# EAGLE design radiata_v2 (EAGLE 6.4)
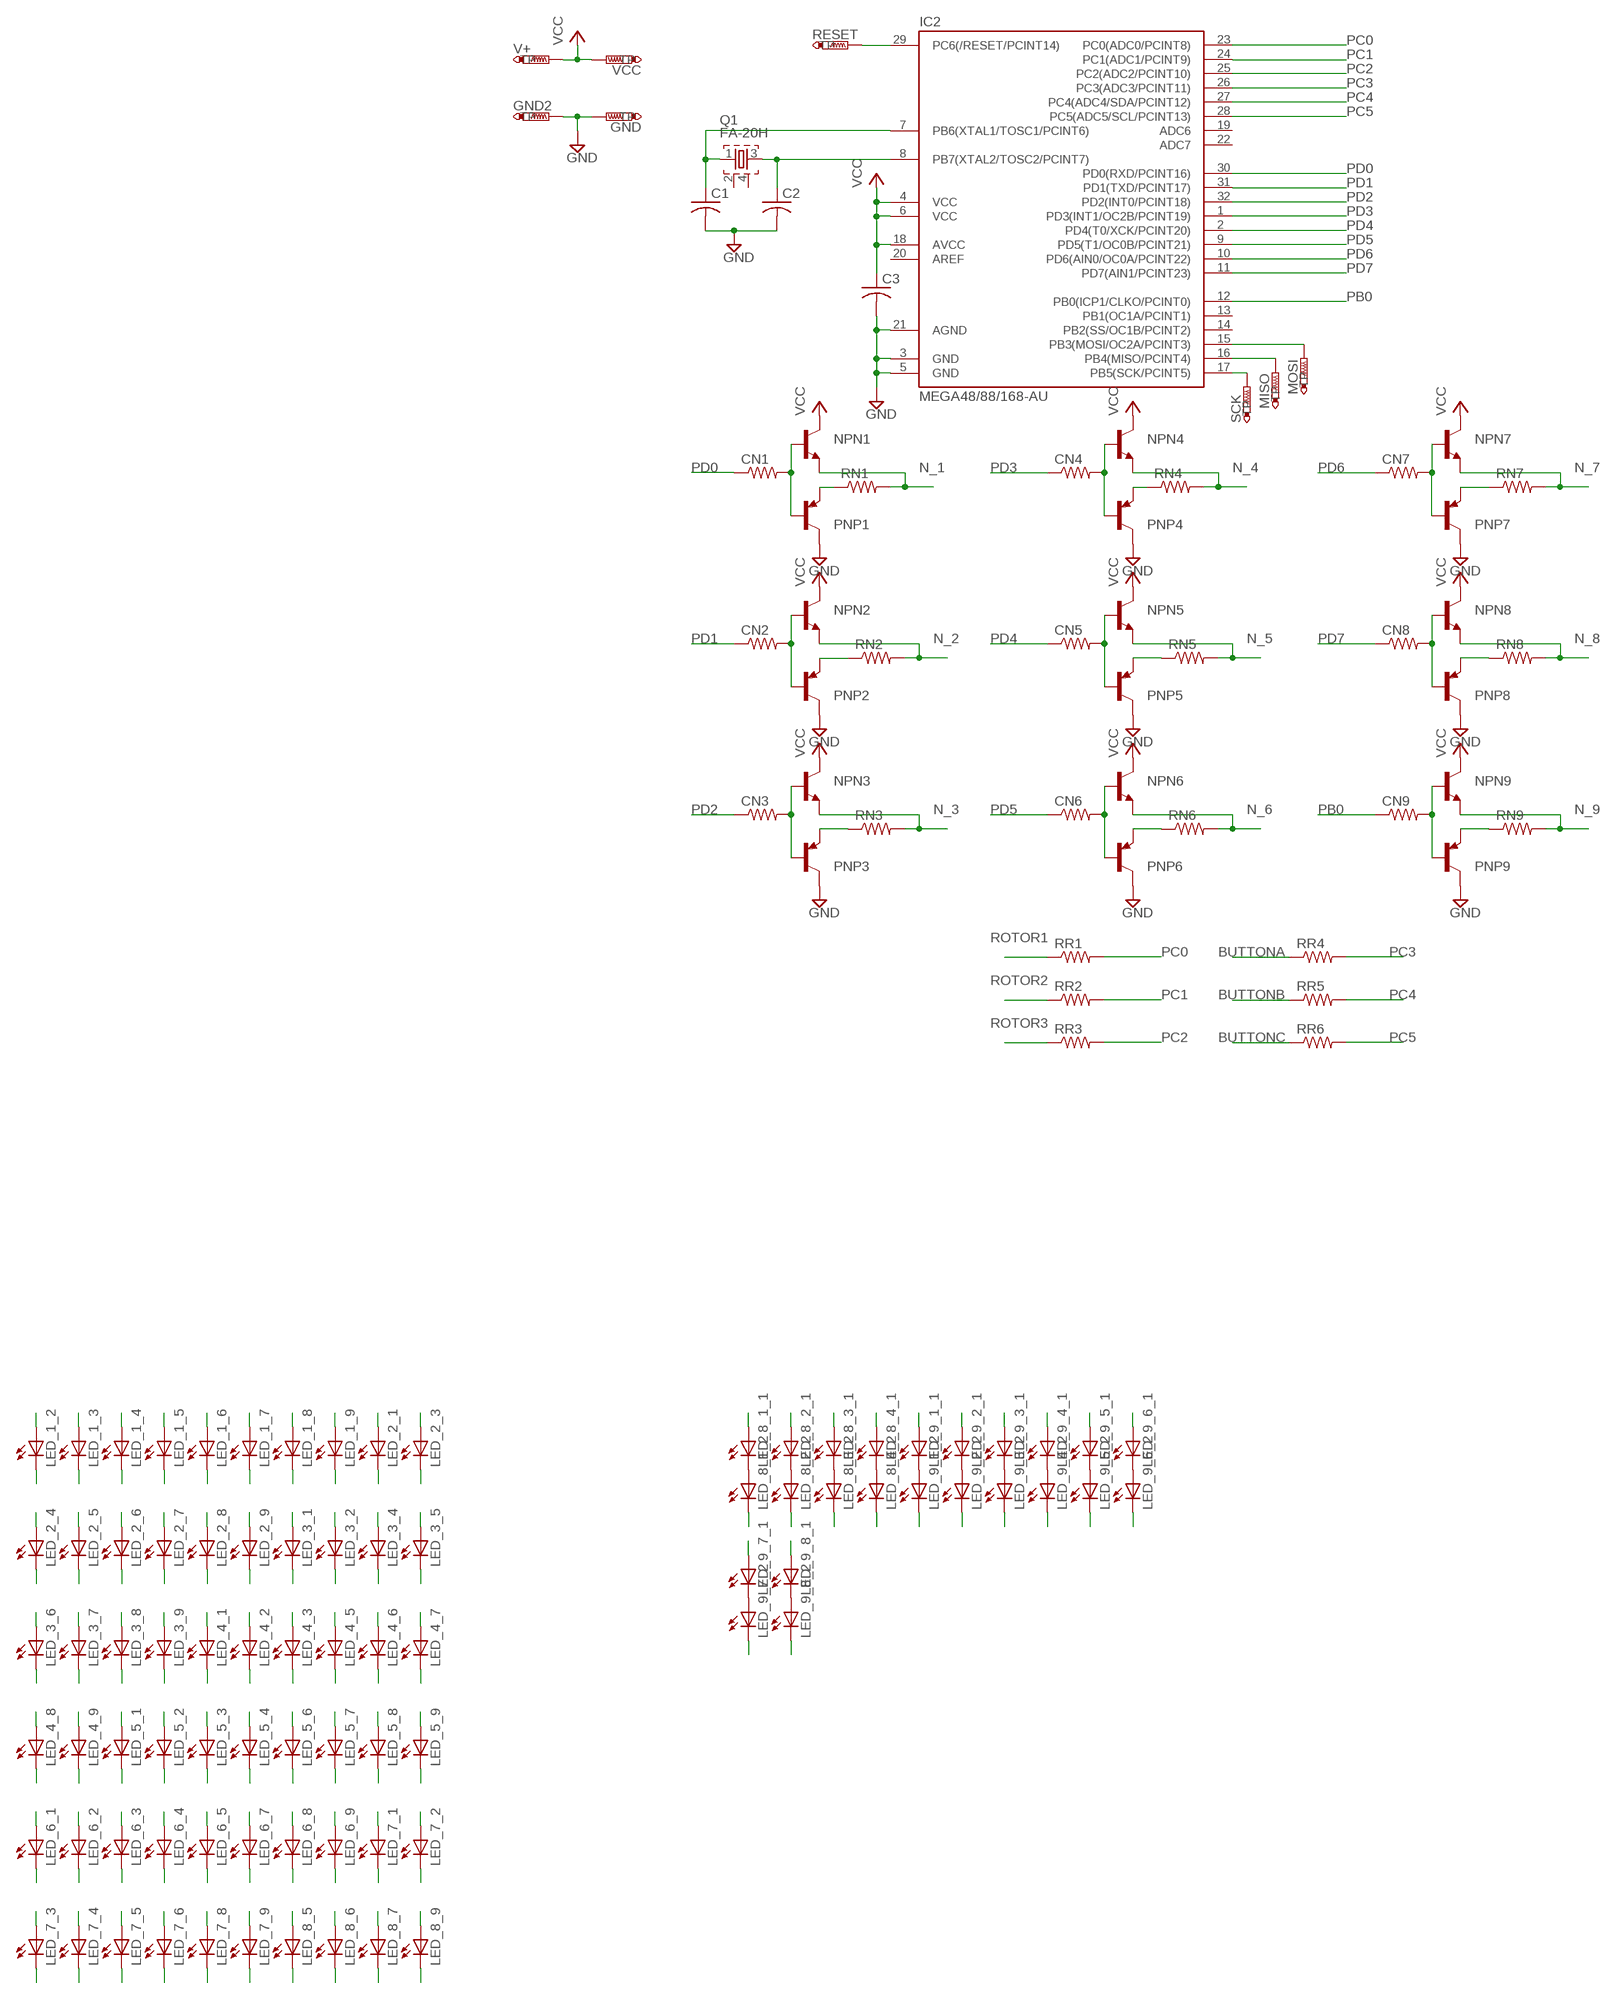
[diagram p0: schematic, sheet 1]

## Parts
C1  C-USC0603  [C0603]
C2  C-USC0603  [C0603]
C3  C-USC0603  [C0603]
CN1  R-US_M0805  [M0805]
CN2  R-US_M0805  [M0805]
CN3  R-US_M0805  [M0805]
CN4  R-US_M0805  [M0805]
CN5  R-US_M0805  [M0805]
CN6  R-US_M0805  [M0805]
CN7  R-US_M0805  [M0805]
CN8  R-US_M0805  [M0805]
CN9  R-US_M0805  [M0805]
GND  PTR1TP19R  [TP19R]
GND2  PTR1TP20SQ  [TP20SQ]
IC2  MEGA48/88/168-AU  [TQFP32-08]
LED_1_2  LED1206  [LED-1206]
LED_1_3  LED1206  [LED-1206]
LED_1_4  LED1206  [LED-1206]
LED_1_5  LED1206  [LED-1206]
LED_1_6  LED1206  [LED-1206]
LED_1_7  LED1206  [LED-1206]
LED_1_8  LED1206  [LED-1206]
LED_1_9  LED1206  [LED-1206]
LED_2_1  LED1206  [LED-1206]
LED_2_3  LED1206  [LED-1206]
LED_2_4  LED1206  [LED-1206]
LED_2_5  LED1206  [LED-1206]
LED_2_6  LED1206  [LED-1206]
LED_2_7  LED1206  [LED-1206]
LED_2_8  LED1206  [LED-1206]
LED_2_9  LED1206  [LED-1206]
LED_3_1  LED1206  [LED-1206]
LED_3_2  LED1206  [LED-1206]
LED_3_4  LED1206  [LED-1206]
LED_3_5  LED1206  [LED-1206]
LED_3_6  LED1206  [LED-1206]
LED_3_7  LED1206  [LED-1206]
LED_3_8  LED1206  [LED-1206]
LED_3_9  LED1206  [LED-1206]
LED_4_1  LED1206  [LED-1206]
LED_4_2  LED1206  [LED-1206]
LED_4_3  LED1206  [LED-1206]
LED_4_5  LED1206  [LED-1206]
LED_4_6  LED1206  [LED-1206]
LED_4_7  LED1206  [LED-1206]
LED_4_8  LED1206  [LED-1206]
LED_4_9  LED1206  [LED-1206]
LED_5_1  LED1206  [LED-1206]
LED_5_2  LED1206  [LED-1206]
LED_5_3  LED1206  [LED-1206]
LED_5_4  LED1206  [LED-1206]
LED_5_6  LED1206  [LED-1206]
LED_5_7  LED1206  [LED-1206]
LED_5_8  LED1206  [LED-1206]
LED_5_9  LED1206  [LED-1206]
LED_6_1  LED1206  [LED-1206]
LED_6_2  LED1206  [LED-1206]
LED_6_3  LED1206  [LED-1206]
LED_6_4  LED1206  [LED-1206]
LED_6_5  LED1206  [LED-1206]
LED_6_7  LED1206  [LED-1206]
LED_6_8  LED1206  [LED-1206]
LED_6_9  LED1206  [LED-1206]
LED_7_1  LED1206  [LED-1206]
LED_7_2  LED1206  [LED-1206]
LED_7_3  LED1206  [LED-1206]
LED_7_4  LED1206  [LED-1206]
LED_7_5  LED1206  [LED-1206]
LED_7_6  LED1206  [LED-1206]
LED_7_8  LED1206  [LED-1206]
LED_7_9  LED1206  [LED-1206]
LED_8_1_1  LED1206  [LED-1206]
LED_8_1_2  LED1206  [LED-1206]
LED_8_2_1  LED1206  [LED-1206]
LED_8_2_2  LED1206  [LED-1206]
LED_8_3_1  LED1206  [LED-1206]
LED_8_3_2  LED1206  [LED-1206]
LED_8_4_1  LED1206  [LED-1206]
LED_8_4_2  LED1206  [LED-1206]
LED_8_5  LED1206  [LED-1206]
LED_8_6  LED1206  [LED-1206]
LED_8_7  LED1206  [LED-1206]
LED_8_9  LED1206  [LED-1206]
LED_9_1_1  LED1206  [LED-1206]
LED_9_1_2  LED1206  [LED-1206]
LED_9_2_1  LED1206  [LED-1206]
LED_9_2_2  LED1206  [LED-1206]
LED_9_3_1  LED1206  [LED-1206]
LED_9_3_2  LED1206  [LED-1206]
LED_9_4_1  LED1206  [LED-1206]
LED_9_4_2  LED1206  [LED-1206]
LED_9_5_1  LED1206  [LED-1206]
LED_9_5_2  LED1206  [LED-1206]
LED_9_6_1  LED1206  [LED-1206]
LED_9_6_2  LED1206  [LED-1206]
LED_9_7_1  LED1206  [LED-1206]
LED_9_7_2  LED1206  [LED-1206]
LED_9_8_1  LED1206  [LED-1206]
LED_9_8_2  LED1206  [LED-1206]
MISO  PTR1TP19R  [TP19R]
MOSI  PTR1TP19R  [TP19R]
NPN1  MMBT2222ALT1-NPN-SOT23-BEC  [SOT23-BEC]
NPN2  MMBT2222ALT1-NPN-SOT23-BEC  [SOT23-BEC]
NPN3  MMBT2222ALT1-NPN-SOT23-BEC  [SOT23-BEC]
NPN4  MMBT2222ALT1-NPN-SOT23-BEC  [SOT23-BEC]
NPN5  MMBT2222ALT1-NPN-SOT23-BEC  [SOT23-BEC]
NPN6  MMBT2222ALT1-NPN-SOT23-BEC  [SOT23-BEC]
NPN7  MMBT2222ALT1-NPN-SOT23-BEC  [SOT23-BEC]
NPN8  MMBT2222ALT1-NPN-SOT23-BEC  [SOT23-BEC]
NPN9  MMBT2222ALT1-NPN-SOT23-BEC  [SOT23-BEC]
PNP1  MMBT2907ALT1-PNP-SOT23-BEC  [SOT23-BEC]
PNP2  MMBT2907ALT1-PNP-SOT23-BEC  [SOT23-BEC]
PNP3  MMBT2907ALT1-PNP-SOT23-BEC  [SOT23-BEC]
PNP4  MMBT2907ALT1-PNP-SOT23-BEC  [SOT23-BEC]
PNP5  MMBT2907ALT1-PNP-SOT23-BEC  [SOT23-BEC]
PNP6  MMBT2907ALT1-PNP-SOT23-BEC  [SOT23-BEC]
PNP7  MMBT2907ALT1-PNP-SOT23-BEC  [SOT23-BEC]
PNP8  MMBT2907ALT1-PNP-SOT23-BEC  [SOT23-BEC]
PNP9  MMBT2907ALT1-PNP-SOT23-BEC  [SOT23-BEC]
Q1  FA-20H  [FA-20H]
RESET  PTR1TP19R  [TP19R]
RN1  RESISTOR1206  [1206]
RN2  RESISTOR1206  [1206]
RN3  RESISTOR1206  [1206]
RN4  RESISTOR1206  [1206]
RN5  RESISTOR1206  [1206]
RN6  RESISTOR1206  [1206]
RN7  RESISTOR1206  [1206]
RN8  RESISTOR1206  [1206]
RN9  RESISTOR1206  [1206]
RR1  RESISTOR1206  [1206]
RR2  RESISTOR1206  [1206]
RR3  RESISTOR1206  [1206]
RR4  RESISTOR1206  [1206]
RR5  RESISTOR1206  [1206]
RR6  RESISTOR1206  [1206]
SCK  PTR1TP19R  [TP19R]
V+  PTR1TP20SQ  [TP20SQ]
VCC  PTR1TP19R  [TP19R]

## Nets
BUTTONA: RR4.1
BUTTONB: RR5.1
BUTTONC: RR6.1
GND: C1.2 C2.2 C3.2 GND2.TP GND.TP IC2.3(GND) IC2.5(GND) IC2.21(AGND) PNP1.C PNP2.C PNP3.C PNP4.C PNP5.C PNP6.C PNP7.C PNP8.C PNP9.C
N$5: IC2.29(PC6(/RESET/PCINT14)) RESET.TP
N$6: IC2.17(PB5(SCK/PCINT5)) SCK.TP
N$7: IC2.16(PB4(MISO/PCINT4)) MISO.TP
N$8: IC2.15(PB3(MOSI/OC2A/PCINT3)) MOSI.TP
N$9: PNP1.E RN1.1
N$10: CN1.2 NPN1.B PNP1.B
N$11: PNP2.E RN2.1
N$12: CN2.2 NPN2.B PNP2.B
N$13: PNP3.E RN3.1
N$14: CN3.2 NPN3.B PNP3.B
N$15: PNP4.E RN4.1
N$16: CN4.2 NPN4.B PNP4.B
N$17: PNP5.E RN5.1
N$18: CN5.2 NPN5.B PNP5.B
N$19: PNP6.E RN6.1
N$20: CN6.2 NPN6.B PNP6.B
N$21: C2.1 IC2.8(PB7(XTAL2/TOSC2/PCINT7)) Q1.3
N$22: LED_8_1_1.C LED_8_1_2.A
N$23: LED_8_2_1.C LED_8_2_2.A
N$24: PNP7.E RN7.1
N$25: CN7.2 NPN7.B PNP7.B
N$26: PNP8.E RN8.1
N$27: CN8.2 NPN8.B PNP8.B
N$28: PNP9.E RN9.1
N$29: CN9.2 NPN9.B PNP9.B
N$30: LED_8_3_1.C LED_8_3_2.A
N$31: LED_8_4_1.C LED_8_4_2.A
N$32: LED_9_1_1.C LED_9_1_2.A
N$33: LED_9_2_1.C LED_9_2_2.A
N$34: LED_9_3_1.C LED_9_3_2.A
N$35: LED_9_4_1.C LED_9_4_2.A
N$36: LED_9_5_1.C LED_9_5_2.A
N$37: LED_9_6_1.C LED_9_6_2.A
N$38: LED_9_7_1.C LED_9_7_2.A
N$39: LED_9_8_1.C LED_9_8_2.A
N_1: LED_1_2.A LED_1_3.A LED_1_4.A LED_1_5.A LED_1_6.A LED_1_7.A LED_1_8.A LED_1_9.A LED_2_1.C LED_3_1.C LED_4_1.C LED_5_1.C LED_6_1.C LED_7_1.C LED_8_1_2.C LED_9_1_2.C NPN1.E RN1.2
N_2: LED_1_2.C LED_2_1.A LED_2_3.A LED_2_4.A LED_2_5.A LED_2_6.A LED_2_7.A LED_2_8.A LED_2_9.A LED_3_2.C LED_4_2.C LED_5_2.C LED_6_2.C LED_7_2.C LED_8_2_2.C LED_9_2_2.C NPN2.E RN2.2
N_3: LED_1_3.C LED_2_3.C LED_3_1.A LED_3_2.A LED_3_4.A LED_3_5.A LED_3_6.A LED_3_7.A LED_3_8.A LED_3_9.A LED_4_3.C LED_5_3.C LED_6_3.C LED_7_3.C LED_8_3_2.C LED_9_3_2.C NPN3.E RN3.2
N_4: LED_1_4.C LED_2_4.C LED_3_4.C LED_4_1.A LED_4_2.A LED_4_3.A LED_4_5.A LED_4_6.A LED_4_7.A LED_4_8.A LED_4_9.A LED_5_4.C LED_6_4.C LED_7_4.C LED_8_4_2.C LED_9_4_2.C NPN4.E RN4.2
N_5: LED_1_5.C LED_2_5.C LED_3_5.C LED_4_5.C LED_5_1.A LED_5_2.A LED_5_3.A LED_5_4.A LED_5_6.A LED_5_7.A LED_5_8.A LED_5_9.A LED_6_5.C LED_7_5.C LED_8_5.C LED_9_5_2.C NPN5.E RN5.2
N_6: LED_1_6.C LED_2_6.C LED_3_6.C LED_4_6.C LED_5_6.C LED_6_1.A LED_6_2.A LED_6_3.A LED_6_4.A LED_6_5.A LED_6_7.A LED_6_8.A LED_6_9.A LED_7_6.C LED_8_6.C LED_9_6_2.C NPN6.E RN6.2
N_7: LED_1_7.C LED_2_7.C LED_3_7.C LED_4_7.C LED_5_7.C LED_6_7.C LED_7_1.A LED_7_2.A LED_7_3.A LED_7_4.A LED_7_5.A LED_7_6.A LED_7_8.A LED_7_9.A LED_8_7.C LED_9_7_2.C NPN7.E RN7.2
N_8: LED_1_8.C LED_2_8.C LED_3_8.C LED_4_8.C LED_5_8.C LED_6_8.C LED_7_8.C LED_8_1_1.A LED_8_2_1.A LED_8_3_1.A LED_8_4_1.A LED_8_5.A LED_8_6.A LED_8_7.A LED_8_9.A LED_9_8_2.C NPN8.E RN8.2
N_9: LED_1_9.C LED_2_9.C LED_3_9.C LED_4_9.C LED_5_9.C LED_6_9.C LED_7_9.C LED_8_9.C LED_9_1_1.A LED_9_2_1.A LED_9_3_1.A LED_9_4_1.A LED_9_5_1.A LED_9_6_1.A LED_9_7_1.A LED_9_8_1.A NPN9.E RN9.2
PB0: CN9.1 IC2.12(PB0(ICP1/CLKO/PCINT0))
PB1: C1.1 IC2.7(PB6(XTAL1/TOSC1/PCINT6)) Q1.1
PC0: IC2.23(PC0(ADC0/PCINT8)) RR1.2
PC1: IC2.24(PC1(ADC1/PCINT9)) RR2.2
PC2: IC2.25(PC2(ADC2/PCINT10)) RR3.2
PC3: IC2.26(PC3(ADC3/PCINT11)) RR4.2
PC4: IC2.27(PC4(ADC4/SDA/PCINT12)) RR5.2
PC5: IC2.28(PC5(ADC5/SCL/PCINT13)) RR6.2
PD0: CN1.1 IC2.30(PD0(RXD/PCINT16))
PD1: CN2.1 IC2.31(PD1(TXD/PCINT17))
PD2: CN3.1 IC2.32(PD2(INT0/PCINT18))
PD3: CN4.1 IC2.1(PD3(INT1/OC2B/PCINT19))
PD4: CN5.1 IC2.2(PD4(T0/XCK/PCINT20))
PD5: CN6.1 IC2.9(PD5(T1/OC0B/PCINT21))
PD6: CN7.1 IC2.10(PD6(AIN0/OC0A/PCINT22))
PD7: CN8.1 IC2.11(PD7(AIN1/PCINT23))
ROTOR1: RR1.1
ROTOR2: RR2.1
ROTOR3: RR3.1
VCC: C3.1 IC2.4(VCC) IC2.6(VCC) IC2.18(AVCC) NPN1.C NPN2.C NPN3.C NPN4.C NPN5.C NPN6.C NPN7.C NPN8.C NPN9.C V+.TP VCC.TP
Unconnected: IC2.13(PB1(OC1A/PCINT1)) IC2.14(PB2(SS/OC1B/PCINT2)) IC2.19(ADC6) IC2.20(AREF) IC2.22(ADC7) Q1.2 Q1.4

## Library data of the parts
C1-C3 = rcl:C-US: CAPACITOR, American symbol
CN1-CN9 = rcl:R-US_: RESISTOR, American symbol
GND GND2 MISO MOSI RESET SCK V+ VCC = testpad:PTR1: TEST PIN
IC2 = avr-7:MEGA48/88/168
LED_1_2-LED_1_9 LED_2_1 LED_2_3-LED_2_9 LED_3_1 LED_3_2 LED_3_4-LED_3_9 LED_4_1-LED_4_3 LED_4_5-LED_4_9 LED_5_1-LED_5_4 LED_5_6-LED_5_9 LED_6_1-LED_6_5 LED_6_7-LED_6_9 LED_7_1-LED_7_6 LED_7_8 LED_7_9 LED_8_1_1 LED_8_1_2 LED_8_2_1 LED_8_2_2 LED_8_3_1 LED_8_3_2 LED_8_4_1 LED_8_4_2 LED_8_5-LED_8_7 LED_8_9 LED_9_1_1 LED_9_1_2 LED_9_2_1 LED_9_2_2 LED_9_3_1 LED_9_3_2 LED_9_4_1 LED_9_4_2 LED_9_5_1 LED_9_5_2 LED_9_6_1 LED_9_6_2 LED_9_7_1 LED_9_7_2 LED_9_8_1 LED_9_8_2 = SparkFun:LED: LEDs Standard schematic elements and footprints for 5mm, 3mm, 1206, and 0603 sized LEDs. 5mm - Spark Fun Electronics SKU : COM-00529 (and others)
NPN1-NPN9 = transistor:*-NPN-: NPN Transistror BF959 corrected 2008.03.06
PNP1-PNP9 = transistor:*-PNP-: PNP Transistror
Q1 = crystal:FA-: MHz RANGE CRYSTAL UNIT Source: Epson Toyocom
RN1-RN9 RR1-RR6 = SparkFun:RESISTOR: Resistor Basic schematic elements and footprints for 0603, 1206, and PTH resistors.

## Board
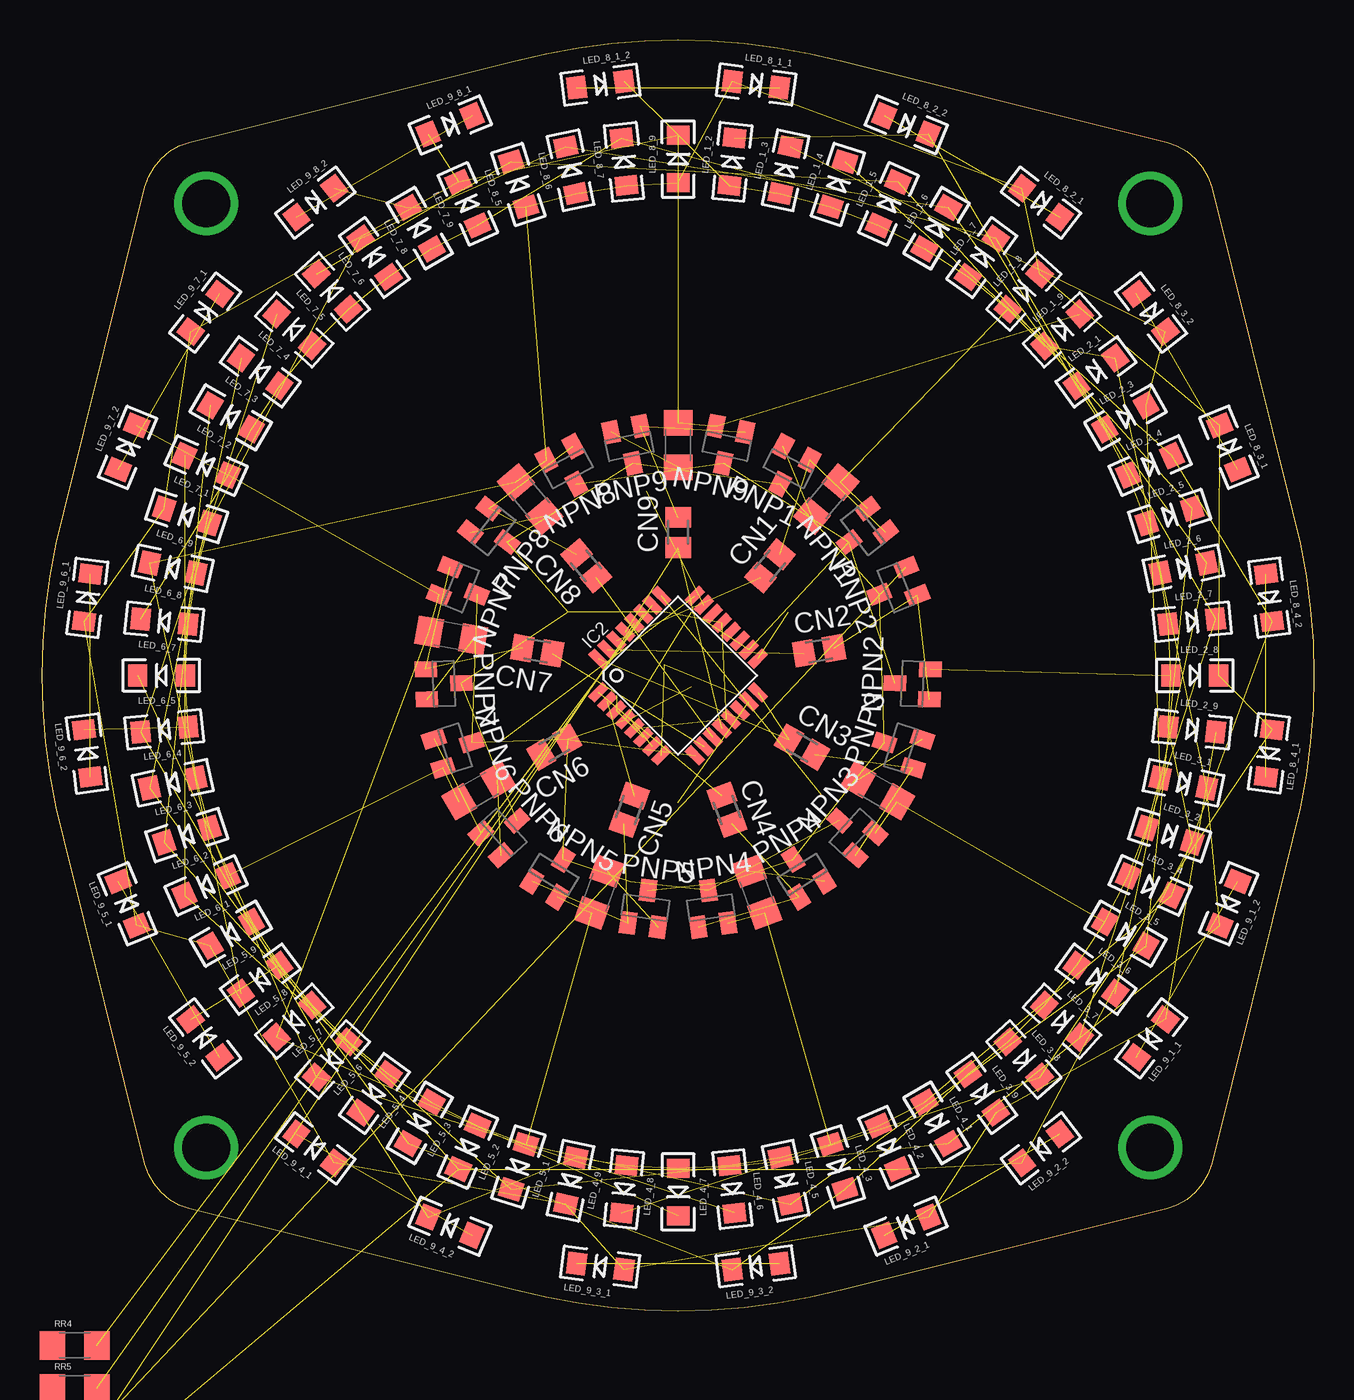
[diagram p1: board, top side]
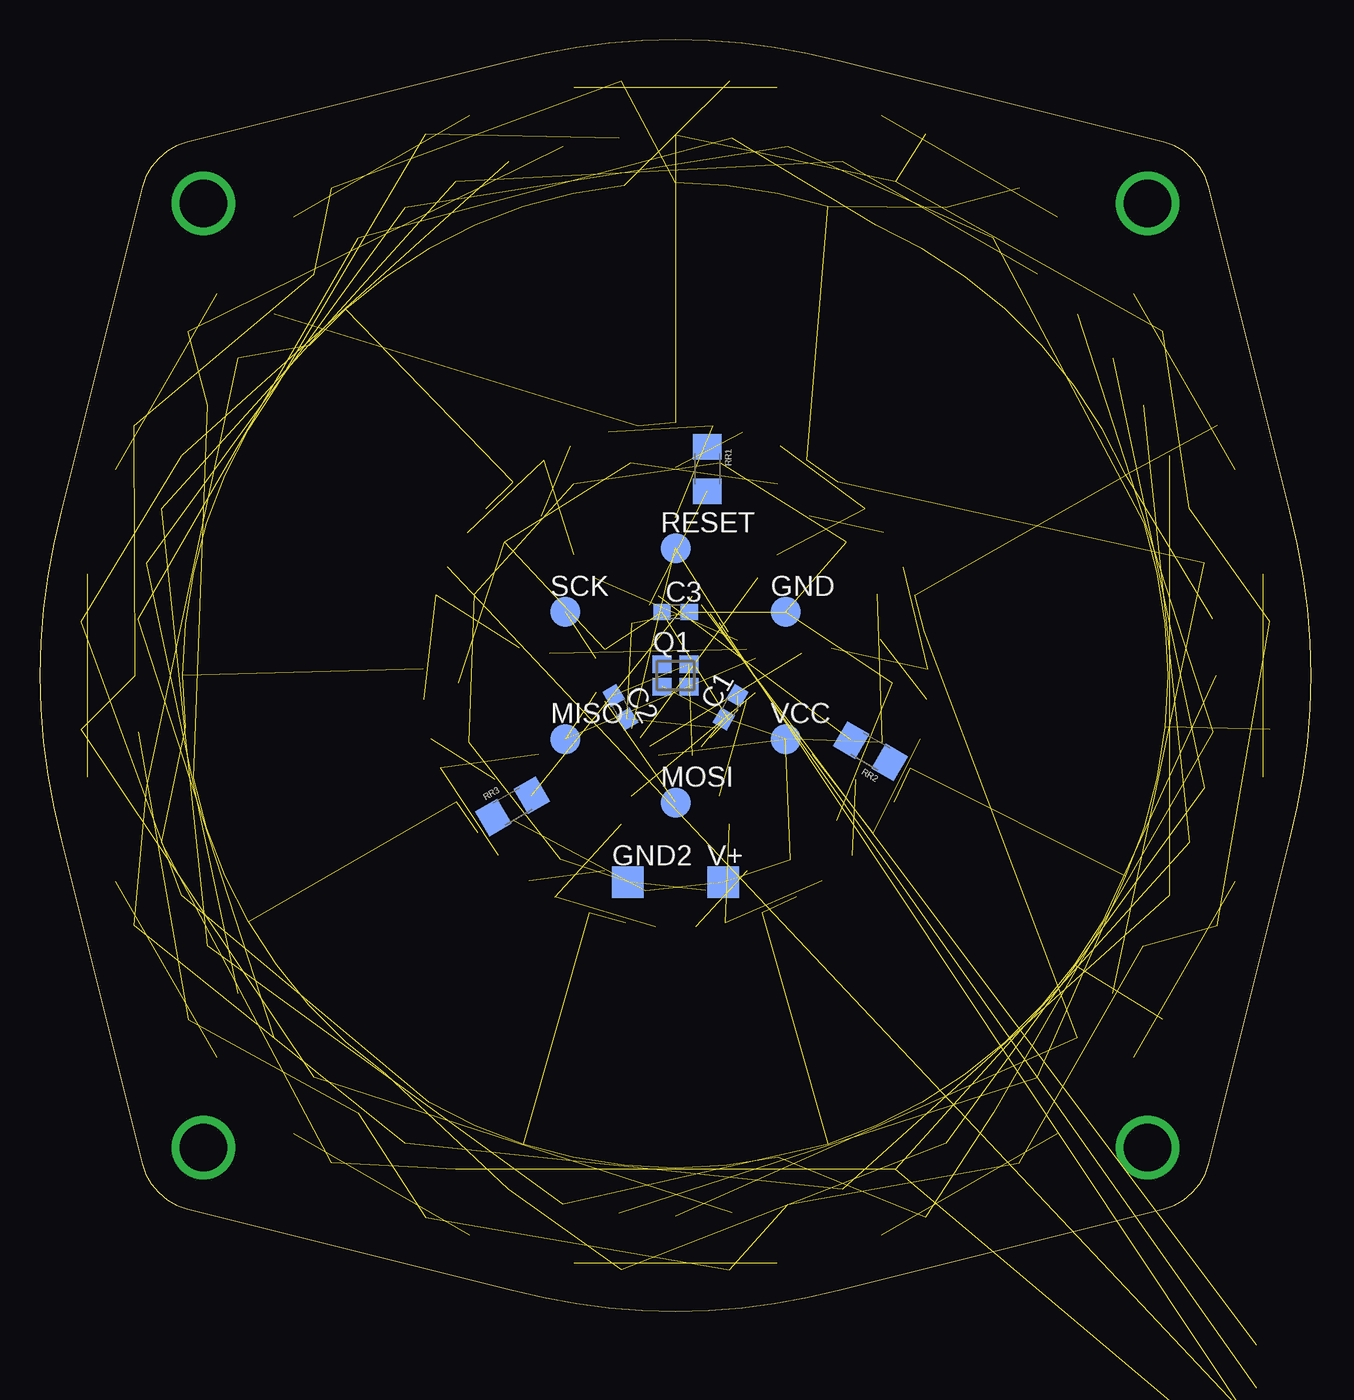
[diagram p2: board, bottom side, seen from below]

Size 80 x 80 mm. Coordinates in mm from the lower left corner, seen from the top.
Outline: 0,40 0.06,42.09 0.22,44.18 0.49,46.26 0.87,48.32 1.36,50.35 6.44,70.73 6.68,71.39 7.03,71.99 7.47,72.53 8.01,72.97 8.61,73.32 9.27,73.56 29.65,78.64 31.68,79.13 33.74,79.51 35.82,79.78 37.91,79.94 40,80 42.09,79.94 44.18,79.78 46.26,79.51 48.32,79.13 50.35,78.64 70.73,73.56 71.39,73.32 71.99,72.97 72.53,72.53 72.97,71.99 73.32,71.39 73.56,70.73 78.64,50.35 79.13,48.32 79.51,46.26 79.78,44.18 79.94,42.09 80,40 79.94,37.91 79.78,35.82 79.51,33.74 79.13,31.68 78.64,29.65 73.56,9.27 73.32,8.61 72.97,8.01 72.53,7.47 71.99,7.03 71.39,6.68 70.73,6.44 50.35,1.36 48.32,0.87 46.26,0.49 44.18,0.22 42.09,0.06 40,0 37.91,0.06 35.82,0.22 33.74,0.49 31.68,0.87 29.65,1.36 9.27,6.44 8.61,6.68 8.01,7.03 7.47,7.47 7.03,8.01 6.68,8.61 6.44,9.27 1.36,29.65 0.87,31.68 0.49,33.74 0.22,35.82 0.06,37.91 0,40
Copper layers (1*16): Top 0.035mm / dielectric 0.2mm / Bottom 0.035mm
Design rules "SeeedStudio_DRU_no_angle_20130527 *": minimum track width 8mil, minimum drill 12mil, track to track 6mil, track to pad 6mil, pad to pad 6mil, via to via 6mil, smd to smd 0mil, copper to edge 10mil, drill to drill 10mil, minimum pad ring 6mil, minimum via ring 6mil, stop-mask expansion 2mil, vias tented up to drill 25mil, thermal gap 10mil
bRestrict: area 18.6,19 to 62.5,62.1; area 17.4,39.4 to 20.8,47

### Footprints (pad centres in the part's own frame; a part is rotated, then mirrored left to right if it is on the bottom)
C0603 = smd 1.1 x 1: 1 -0.85,0; 2 0.85,0
M0805 = smd 1.3 x 1.6: 1 -0.95,0; 2 0.95,0
TP19R = smd 1.9 x 1.9: TP 0,0
TP20SQ = smd 2 x 2: TP 0,0
TQFP32-08 = smd 1.27 x 0.559: 1 -4.293,2.8; 2 -4.293,2; 3 -4.293,1.2; 4 -4.293,0.4; 5 -4.293,-0.4; 6 -4.293,-1.2; 7 -4.293,-2; 8 -4.293,-2.8; 17 4.293,-2.8; 18 4.293,-2; 19 4.293,-1.2; 20 4.293,-0.4; 21 4.293,0.4; 22 4.293,1.2; 23 4.293,2; 24 4.293,2.8 | smd 0.559 x 1.27: 9 -2.8,-4.293; 10 -2,-4.293; 11 -1.2,-4.293; 12 -0.4,-4.293; 13 0.4,-4.293; 14 1.2,-4.293; 15 2,-4.293; 16 2.8,-4.293; 25 2.8,4.293; 26 2,4.293; 27 1.2,4.293; 28 0.4,4.293; 29 -0.4,4.293; 30 -1.2,4.293; 31 -2,4.293; 32 -2.8,4.293
LED-1206 = smd 1.2 x 1.4: A -1.5,0; C 1.5,0
SOT23-BEC = smd 1 x 1.4: B -0.95,-1.1; C 0,1.1; E 0.95,-1.1
FA-20H = smd 1.2 x 1.1: 1 -0.85,-0.7; 2 0.85,-0.7; 3 0.85,0.7; 4 -0.85,0.7
1206 = smd 1.6 x 1.8: 1 -1.4,0; 2 1.4,0

### Placement (x,y rotation side)
C1  36.54,38 60 bottom
C2  43.46,38 300 bottom
C3  40,44 0 bottom
CN1  45.79,46.89 50 top
CN2  48.86,41.56 10 top
CN3  47.79,35.5 330 top
CN4  43.08,31.54 290 top
CN5  36.92,31.54 250 top
CN6  32.21,35.5 210 top
CN7  31.14,41.56 170 top
CN8  34.21,46.89 130 top
CN9  40,49 90 top
GND  33.07,44 0 bottom
GND2  43,27 0 bottom
IC2  40,40 45 top
LED_1_2  43.4,72.32 84 top
LED_1_3  46.76,71.79 78 top
LED_1_4  50.04,70.91 72 top
LED_1_5  53.22,69.69 66 top
LED_1_6  56.25,68.15 60 top
LED_1_7  59.1,66.29 54 top
LED_1_8  61.75,64.15 48 top
LED_1_9  64.15,61.75 42 top
LED_2_1  66.29,59.1 36 top
LED_2_3  68.15,56.25 30 top
LED_2_4  69.69,53.22 24 top
LED_2_5  70.91,50.04 18 top
LED_2_6  71.79,46.76 12 top
LED_2_7  72.32,43.4 6 top
LED_2_8  72.5,40 0 top
LED_2_9  72.32,36.6 354 top
LED_3_1  71.79,33.24 348 top
LED_3_2  70.91,29.96 342 top
LED_3_4  69.69,26.78 336 top
LED_3_5  68.15,23.75 330 top
LED_3_6  66.29,20.9 324 top
LED_3_7  64.15,18.25 318 top
LED_3_8  61.75,15.85 312 top
LED_3_9  59.1,13.71 306 top
LED_4_1  56.25,11.85 300 top
LED_4_2  53.22,10.31 294 top
LED_4_3  50.04,9.09 288 top
LED_4_5  46.76,8.21 282 top
LED_4_6  43.4,7.68 276 top
LED_4_7  40,7.5 270 top
LED_4_8  36.6,7.68 264 top
LED_4_9  33.24,8.21 258 top
LED_5_1  29.96,9.09 252 top
LED_5_2  26.78,10.31 246 top
LED_5_3  23.75,11.85 240 top
LED_5_4  20.9,13.71 234 top
LED_5_6  18.25,15.85 228 top
LED_5_7  15.85,18.25 222 top
LED_5_8  13.71,20.9 216 top
LED_5_9  11.85,23.75 210 top
LED_6_1  10.31,26.78 204 top
LED_6_2  9.09,29.96 198 top
LED_6_3  8.21,33.24 192 top
LED_6_4  7.68,36.6 186 top
LED_6_5  7.5,40 180 top
LED_6_7  7.68,43.4 174 top
LED_6_8  8.21,46.76 168 top
LED_6_9  9.09,50.04 162 top
LED_7_1  10.31,53.22 156 top
LED_7_2  11.85,56.25 150 top
LED_7_3  13.71,59.1 144 top
LED_7_4  15.85,61.75 138 top
LED_7_5  18.25,64.15 132 top
LED_7_6  20.9,66.29 126 top
LED_7_8  23.75,68.15 120 top
LED_7_9  26.78,69.69 114 top
LED_8_1_1  44.89,77.18 352.5 top
LED_8_1_2  35.11,77.18 7.5 top
LED_8_2_1  62.83,69.75 322.5 top
LED_8_2_2  54.35,74.65 337.5 top
LED_8_3_1  74.65,54.35 292.5 top
LED_8_3_2  69.75,62.83 307.5 top
LED_8_4_1  77.18,35.11 262.5 top
LED_8_4_2  77.18,44.89 277.5 top
LED_8_5  29.96,70.91 108 top
LED_8_6  33.24,71.79 102 top
LED_8_7  36.6,72.32 96 top
LED_8_9  40,72.5 90 top
LED_9_1_1  69.75,17.17 232.5 top
LED_9_1_2  74.65,25.65 247.5 top
LED_9_2_1  54.35,5.35 202.5 top
LED_9_2_2  62.83,10.25 217.5 top
LED_9_3_1  35.11,2.82 172.5 top
LED_9_3_2  44.89,2.82 187.5 top
LED_9_4_1  17.17,10.25 142.5 top
LED_9_4_2  25.65,5.35 157.5 top
LED_9_5_1  5.35,25.65 112.5 top
LED_9_5_2  10.25,17.17 127.5 top
LED_9_6_1  2.82,44.89 82.5 top
LED_9_6_2  2.82,35.11 97.5 top
LED_9_7_1  10.25,62.83 52.5 top
LED_9_7_2  5.35,54.35 67.5 top
LED_9_8_1  25.65,74.65 22.5 top
LED_9_8_2  17.17,69.75 37.5 top
MISO  46.93,36 0 bottom
MOSI  40,32 0 bottom
NPN1  51.62,49.08 128 top
NPN2  54.74,39.49 88 top
NPN3  50.96,30.13 48 top
NPN4  42.05,25.39 8 top
NPN5  32.18,27.49 328 top
NPN6  25.97,35.44 288 top
NPN7  26.32,45.53 248 top
NPN8  33.08,53.02 208 top
NPN9  43.07,54.43 168 top
PNP1  46.92,53.02 152 top
PNP2  53.68,45.53 112 top
PNP3  54.03,35.44 72 top
PNP4  47.82,27.49 32 top
PNP5  37.95,25.39 352 top
PNP6  29.04,30.13 312 top
PNP7  25.26,39.49 272 top
PNP8  28.38,49.08 232 top
PNP9  36.93,54.43 192 top
Q1  40,40 0 bottom
RESET  40,48 0 bottom
RN1  49.32,51.11 50 top
RN2  2.04,-10.25 0 top  (outside the outline)
RN3  52.56,32.75 330 top
RN4  44.96,26.37 290 top
RN5  35.04,26.37 250 top
RN6  27.44,32.75 210 top
RN7  25.72,42.52 170 top
RN8  30.68,51.11 130 top
RN9  40,54.5 90 top
RR1  38,53 270 bottom
RR2  27.74,35.23 150 bottom
RR3  50.26,31.77 30 bottom
RR4  2.04,-2.15 0 top
RR5  2.04,-4.85 0 top  (outside the outline)
RR6  2.04,-7.55 0 top  (outside the outline)
SCK  46.93,44 0 bottom
V+  37,27 0 bottom
VCC  33.07,36 0 bottom

### Tracks (layer width: path | path; a pad name or v marks a point on that pad's centre or on a via)
GND  (16 unrouted)
N$1  (via drill 3)
  other vias: 10.3,10.3
N$2  (via drill 3)
  other vias: 10.3,69.7
N$3  (via drill 3)
  other vias: 69.7,69.7
N$4  (via drill 3)
  other vias: 69.7,10.3
N$5  (1 unrouted)
N$6  (1 unrouted)
N$7  (1 unrouted)
N$8  (1 unrouted)
N$9  (1 unrouted)
N$10  (2 unrouted)
N$11  (1 unrouted)
N$12  (2 unrouted)
N$13  (1 unrouted)
N$14  (2 unrouted)
N$15  (1 unrouted)
N$16  (2 unrouted)
N$17  (1 unrouted)
N$18  (2 unrouted)
N$19  (1 unrouted)
N$20  (2 unrouted)
N$21  (2 unrouted)
N$22  (1 unrouted)
N$23  (1 unrouted)
N$24  (1 unrouted)
N$25  (2 unrouted)
N$26  (1 unrouted)
N$27  (2 unrouted)
N$28  (1 unrouted)
N$29  (2 unrouted)
N$30  (1 unrouted)
N$31  (1 unrouted)
N$32  (1 unrouted)
N$33  (1 unrouted)
N$34  (1 unrouted)
N$35  (1 unrouted)
N$36  (1 unrouted)
N$37  (1 unrouted)
N$38  (1 unrouted)
N$39  (1 unrouted)
N_1  (17 unrouted)
N_2  (17 unrouted)
N_3  (17 unrouted)
N_4  (17 unrouted)
N_5  (17 unrouted)
N_6  (17 unrouted)
N_7  (17 unrouted)
N_8  (17 unrouted)
N_9  (17 unrouted)
PB0  (1 unrouted)
PB1  (2 unrouted)
PC0  (1 unrouted)
PC1  (1 unrouted)
PC2  (1 unrouted)
PC3  (1 unrouted)
PC4  (1 unrouted)
PC5  (1 unrouted)
PD0  (1 unrouted)
PD1  (1 unrouted)
PD2  (1 unrouted)
PD3  (1 unrouted)
PD4  (1 unrouted)
PD5  (1 unrouted)
PD6  (1 unrouted)
PD7  (1 unrouted)
VCC  (14 unrouted)